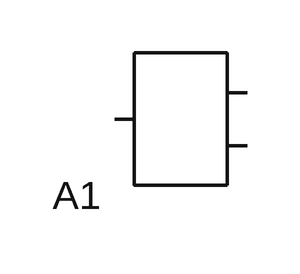
[diagram p0: schematic Draft7.asc]
Draft7.asc, the LTspice schematic file:
Version 4
SHEET 1 880 680
SYMBOL SpecialFunctions\\ota 352 368 R180
SYMATTR InstName A1

The netlist it stands for:
* Draft7.asc
A1 0 0 0 0 0 0 0 0 OTA
.backanno
.end